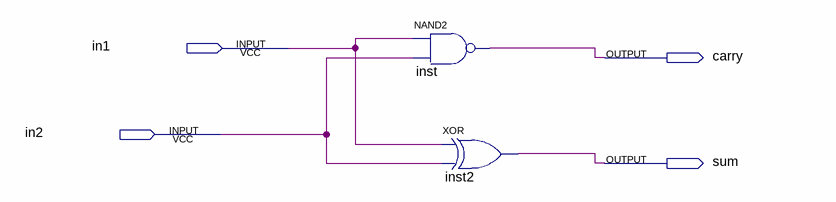
[diagram p0: schematic sheet]
// Quartus schematic half_adder.bdf as structural Verilog: 2 symbols, 4 pins
module half_adder (
  input  in1,
  input  in2,
  output carry,
  output sum
);

  nand inst (carry, in1, in2);
  xor inst2 (sum, in1, in2);
endmodule
